# EasyEDA Pro project smart-switch-v2.eprj, board base-board
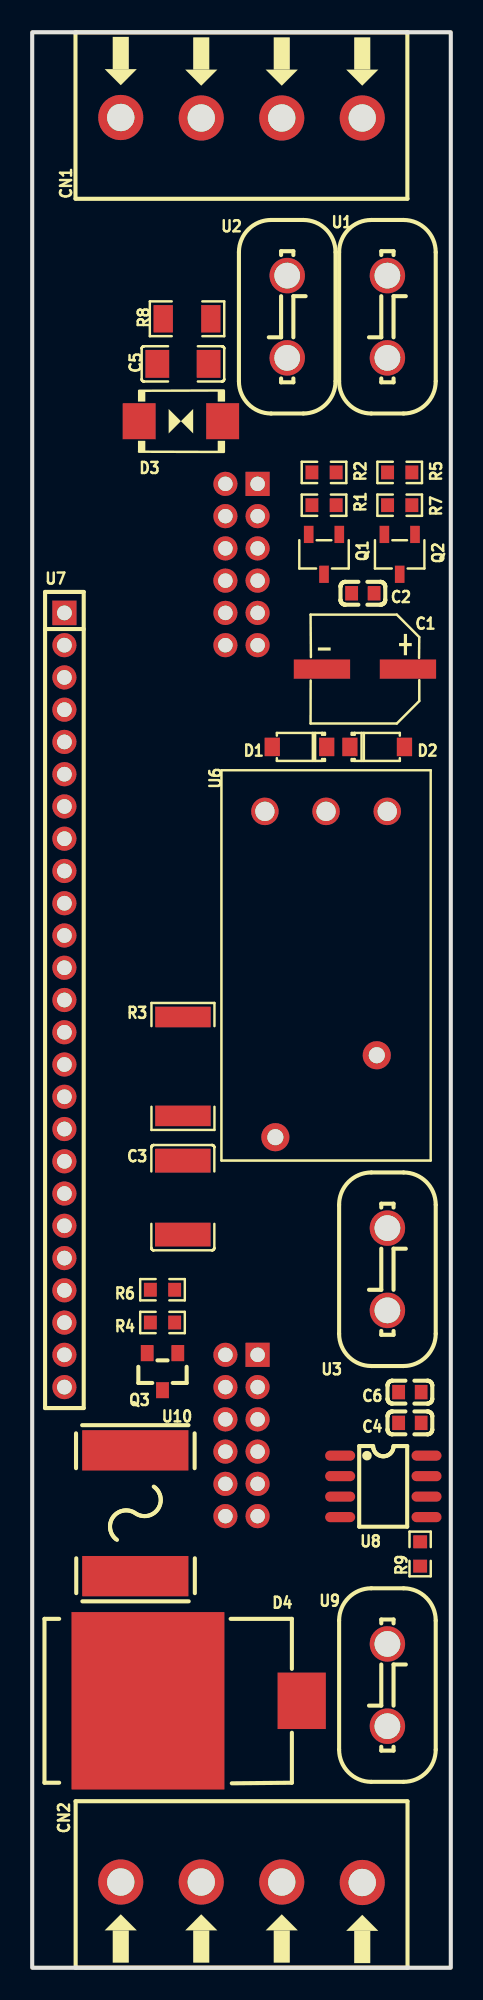
[diagram p5: board, top side]
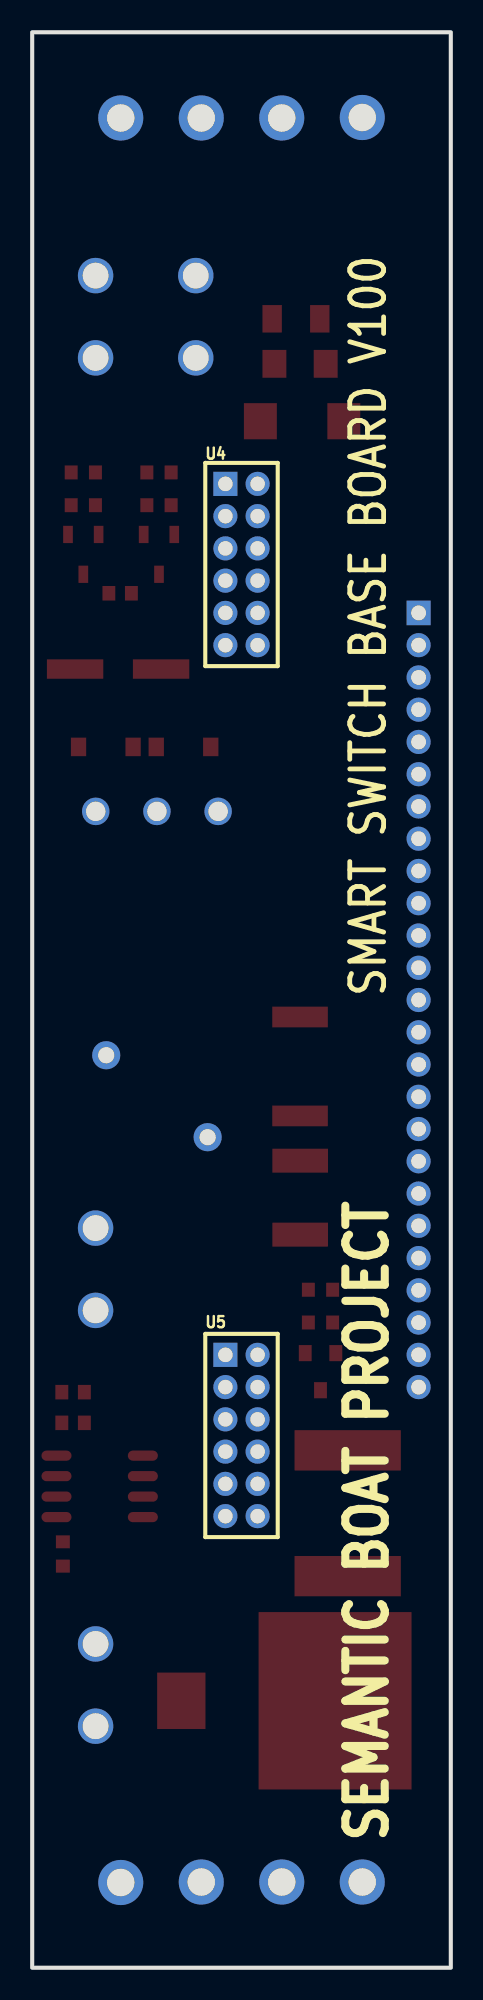
[diagram p6: board, bottom side, seen from below]

Outline 26 x 120 mm; copper layers: Top Layer, Bottom Layer. Coordinates in mm from the lower left corner of the outline.
Outline path: rectangle 0,120 26,0
Stack: Top Layer 0.035mm / Dielectric1 1.51mm FR4 er 4.5 / Bottom Layer 0.035mm

## Design rules (mm)
template: JLCPCB Capability(Two Layers Board)
spacing copperThickness1oz (default): track to track 0.102, other pairs 0.152 to 0.3
spacing copperThickness2oz: track to track 0.203, other pairs 0.152 to 0.3
track width copperThickness1oz (default): min 0.127, default 0.254, max 2.54
track width copperThickness2oz: min 0.203, default 0.254, max 2.54
differential pair differentialPair (default): width min 0.127, default 0.254, max 2.54; gap min 0.152, default 0.152
via viaSize (default): diameter min 0.5, default 0.61, max 10; hole min 0.3, default 0.305, max 6.3

## Placement (name value [footprint] x y rotation side)
C1  100uF  [CAP-SMD_BD6.3-L6.6-W6.6-LS7.6-RD]  20.67 80.52 180 top
C2  100nF  [C0603]  20.54 85.22 0 top
C3  220nF  [C1812]  9.36 47.75 90 top
C4  100nF  [C0603]  23.46 33.78 180 top
C5  2.2nF  [C1206]  9.36 99.44 180 top
C6  1nF  [C0603]  23.46 35.69 0 top
CN1  WJ128V-5.0-4P  [CONN-TH_4P-P5.00_WJ128V-4P-5.0-14-00A]  13 114.7 180 top
CN2  WJ128V-5.0-4P  [CONN-TH_4P-P5.00_WJ128V-4P-5.0-14-00A]  13 5.3 0 top
D1  1N4148W  [SOD-123_L2.8-W1.8-LS3.7-RD]  16.6 75.69 180 top
D2  1N4148W  [SOD-123_L2.8-W1.8-LS3.7-RD]  21.43 75.69 0 top
D3  SMBJ28CA  [SMB_L4.6-W3.6-LS5.3-BI]  9.24 95.89 0 top
D4  SM8S24A  [DO-218AB_L13.5-W8.4-LS15.5-FD]  11.96 16.55 0 top
Q1  2N7002K-T1-GE3  [SOT-23-3_L2.9-W1.6-P1.90-LS2.8-BR]  18.13 87.63 90 top
Q2  2N7002K-T1-GE3  [SOT-23-3_L2.9-W1.6-P1.90-LS2.8-BR]  22.82 87.63 90 top
Q3  AO3401A  [SOT-23_L2.9-W1.3-P1.90-LS2.4-BR]  8.09 36.96 90 top
R1  1kΩ  [R0603]  18.13 90.68 0 top
R2  100kΩ  [R0603]  18.13 92.71 0 top
R3  100Ω  [R2512]  9.36 55.88 90 top
R4  100kΩ  [R0603]  8.09 40 180 top
R5  1kΩ  [R0603]  22.82 92.71 0 top
R6  100Ω  [R0603]  8.09 42.04 0 top
R7  100kΩ  [R0603]  22.82 90.68 180 top
R8  1MΩ  [R1206]  9.62 102.23 0 top
R9  470kΩ  [R0603]  24.09 25.65 90 top
U1  G630-09-3T  [CONN-TH_2P-L8.2-W0.8-P5.10]  22.06 102.36 90 top
U2  G630-09-3T  [CONN-TH_2P-L8.2-W0.8-P5.10]  15.84 102.36 90 top
U3  G630-09-3T  [CONN-TH_2P-L8.2-W0.8-P5.10]  22.06 43.31 270 top
U4  2005FV-2x6P  [HDR-TH_12P-P2.00-V-F-R2-C6-S2.00]  13 87 270 bottom
U5  2005FV-2x6P  [HDR-TH_12P-P2.00-V-F-R2-C6-S2.00]  13 33 270 bottom
U6  PRL2-12V-DC-1A  [RELAY_PRL2-5V-DC-1A]  18.25 61.59 270 top
U7  DW200R-11-25-43  [HDR-TH_25P-P2.00-V-F-1]  2 60 270 top
U8  ACS724LLCTR-20AU-T-JSM  [SOP-8_L4.9-W3.9-P1.27-LS6.0-BL]  21.81 29.84 270 top
U9  G630-09-3T  [CONN-TH_2P-L8.2-W0.8-P5.10]  22.06 17.53 90 top
U10  BSMD3425-200-60V  [FUSE-SMD_L8.6-W6.4]  6.41 28.18 90 top

## Footprints (pads in the part's own frame, mm; a bottom-side part is the same pattern mirrored in y, then rotated)
C0603
  rect 0.8x0.9 smd: 1(-0.7,0) 2(0.7,0)
C1206
  rect 1.485x1.728 smd: 1(-1.593,0) 2(1.593,0)
C1812
  rect 1.485x3.456 smd: 1(-2.292,0) 2(2.292,0)
CAP-SMD_BD6.3-L6.6-W6.6-LS7.6-RD
  rect 3.5x1.2 smd: 1(-2.67,0) 2(2.67,0)
CONN-TH_2P-L8.2-W0.8-P5.10
  round 2.2 hole 1.6: 1(-2.55,0) 2(2.55,0)
CONN-TH_4P-P5.00_WJ128V-4P-5.0-14-00A
  round 2.8 hole 1.7: 1(-7.5,0.015) 2(-2.5,0.015) 3(2.5,0.015) 4(7.5,-0.015)
DO-218AB_L13.5-W8.4-LS15.5-FD
  rect 3x3.5 smd: 1(4.775,0)
  rect 9.5x11 smd: 2(-4.775,0)
FUSE-SMD_L8.6-W6.4
  rect 2.5x6.6 smd: 1(-3.9,0) 2(3.9,0)
HDR-TH_12P-P2.00-V-F-R2-C6-S2.00
  rect 1.5x1.5 hole 0.9: 1(-5,-1)
  round 1.5 hole 0.9: 2(-5,1) 3(-3,-1) 4(-3,1) 5(-1,-1) 6(-1,1) 7(1,-1) 8(1,1) 9(3,-1) 10(3,1) 11(5,-1) 12(5,1)
HDR-TH_25P-P2.00-V-F-1
  rect 1.524x1.5 hole 0.914: 1(-24,0)
  round 1.5 hole 0.914: 2(-22,0) 3(-20,0) 4(-18,0) 5(-16,0) 6(-14,0) 7(-12,0) 8(-10,0) 9(-8,0) 10(-6,0) 11(-4,0) 12(-2,0) 13(0,0) 14(2,0) 15(4,0) 16(6,0) 17(8,0) 18(10,0) 19(12,0) 20(14,0) 21(16,0) 22(18,0) 23(20,0) 24(22,0) 25(24,0)
R0603
  rect 0.806x0.864 smd: 1(-0.753,0) 2(0.753,0)
R1206
  rect 1.208x1.701 smd: 1(-1.479,0) 2(1.479,0)
R2512
  rect 1.282x3.456 smd: 1(-3.067,0) 2(3.067,0)
RELAY_PRL2-5V-DC-1A
  round 1.708 hole 1.2: C1(-10.1,-3.8) C2(-10.1,0) C3(-10.1,3.8)
  round 1.75 hole 1: COM(5.02,3.15) NO(10.1,-3.15)
SMB_L4.6-W3.6-LS5.3-BI
  rect 2.047x2.241 smd: 1(-2.591,0) 2(2.591,0)
SOD-123_L2.8-W1.8-LS3.7-RD
  rect 0.95x1.15 smd: 1(-1.692,0) 2(1.692,0)
SOP-8_L4.9-W3.9-P1.27-LS6.0-BL
  oval 0.63x1.865 smd: 1(-1.905,-2.683) 2(-0.635,-2.683) 3(0.635,-2.683) 4(1.905,-2.683) 5(1.905,2.683) 6(0.635,2.683) 7(-0.635,2.683) 8(-1.905,2.683)
SOT-23-3_L2.9-W1.6-P1.90-LS2.8-BR
  rect 1.07x0.6 smd: 1(1.235,-0.95) 2(1.235,0.95) 3(-1.235,0)
SOT-23_L2.9-W1.3-P1.90-LS2.4-BR
  rect 1x0.8 smd: 1(1.15,-0.95) 2(1.15,0.95) 3(-1.15,0)

## Nets
As in the schematic.

## Text on the board
Bottom Silkscreen Layer: SMART SWITCH BASE BOARD V100 | SEMANTIC BOAT PROJECT
